# Altium project BE-PC_EXP_V100.PrjPcb (part 4 of 4)

## Sheet 06_SAMA7G54-DDR3.SchDoc
size 420 x 297 mm; SheetNumber: 29; SheetTotal: 29
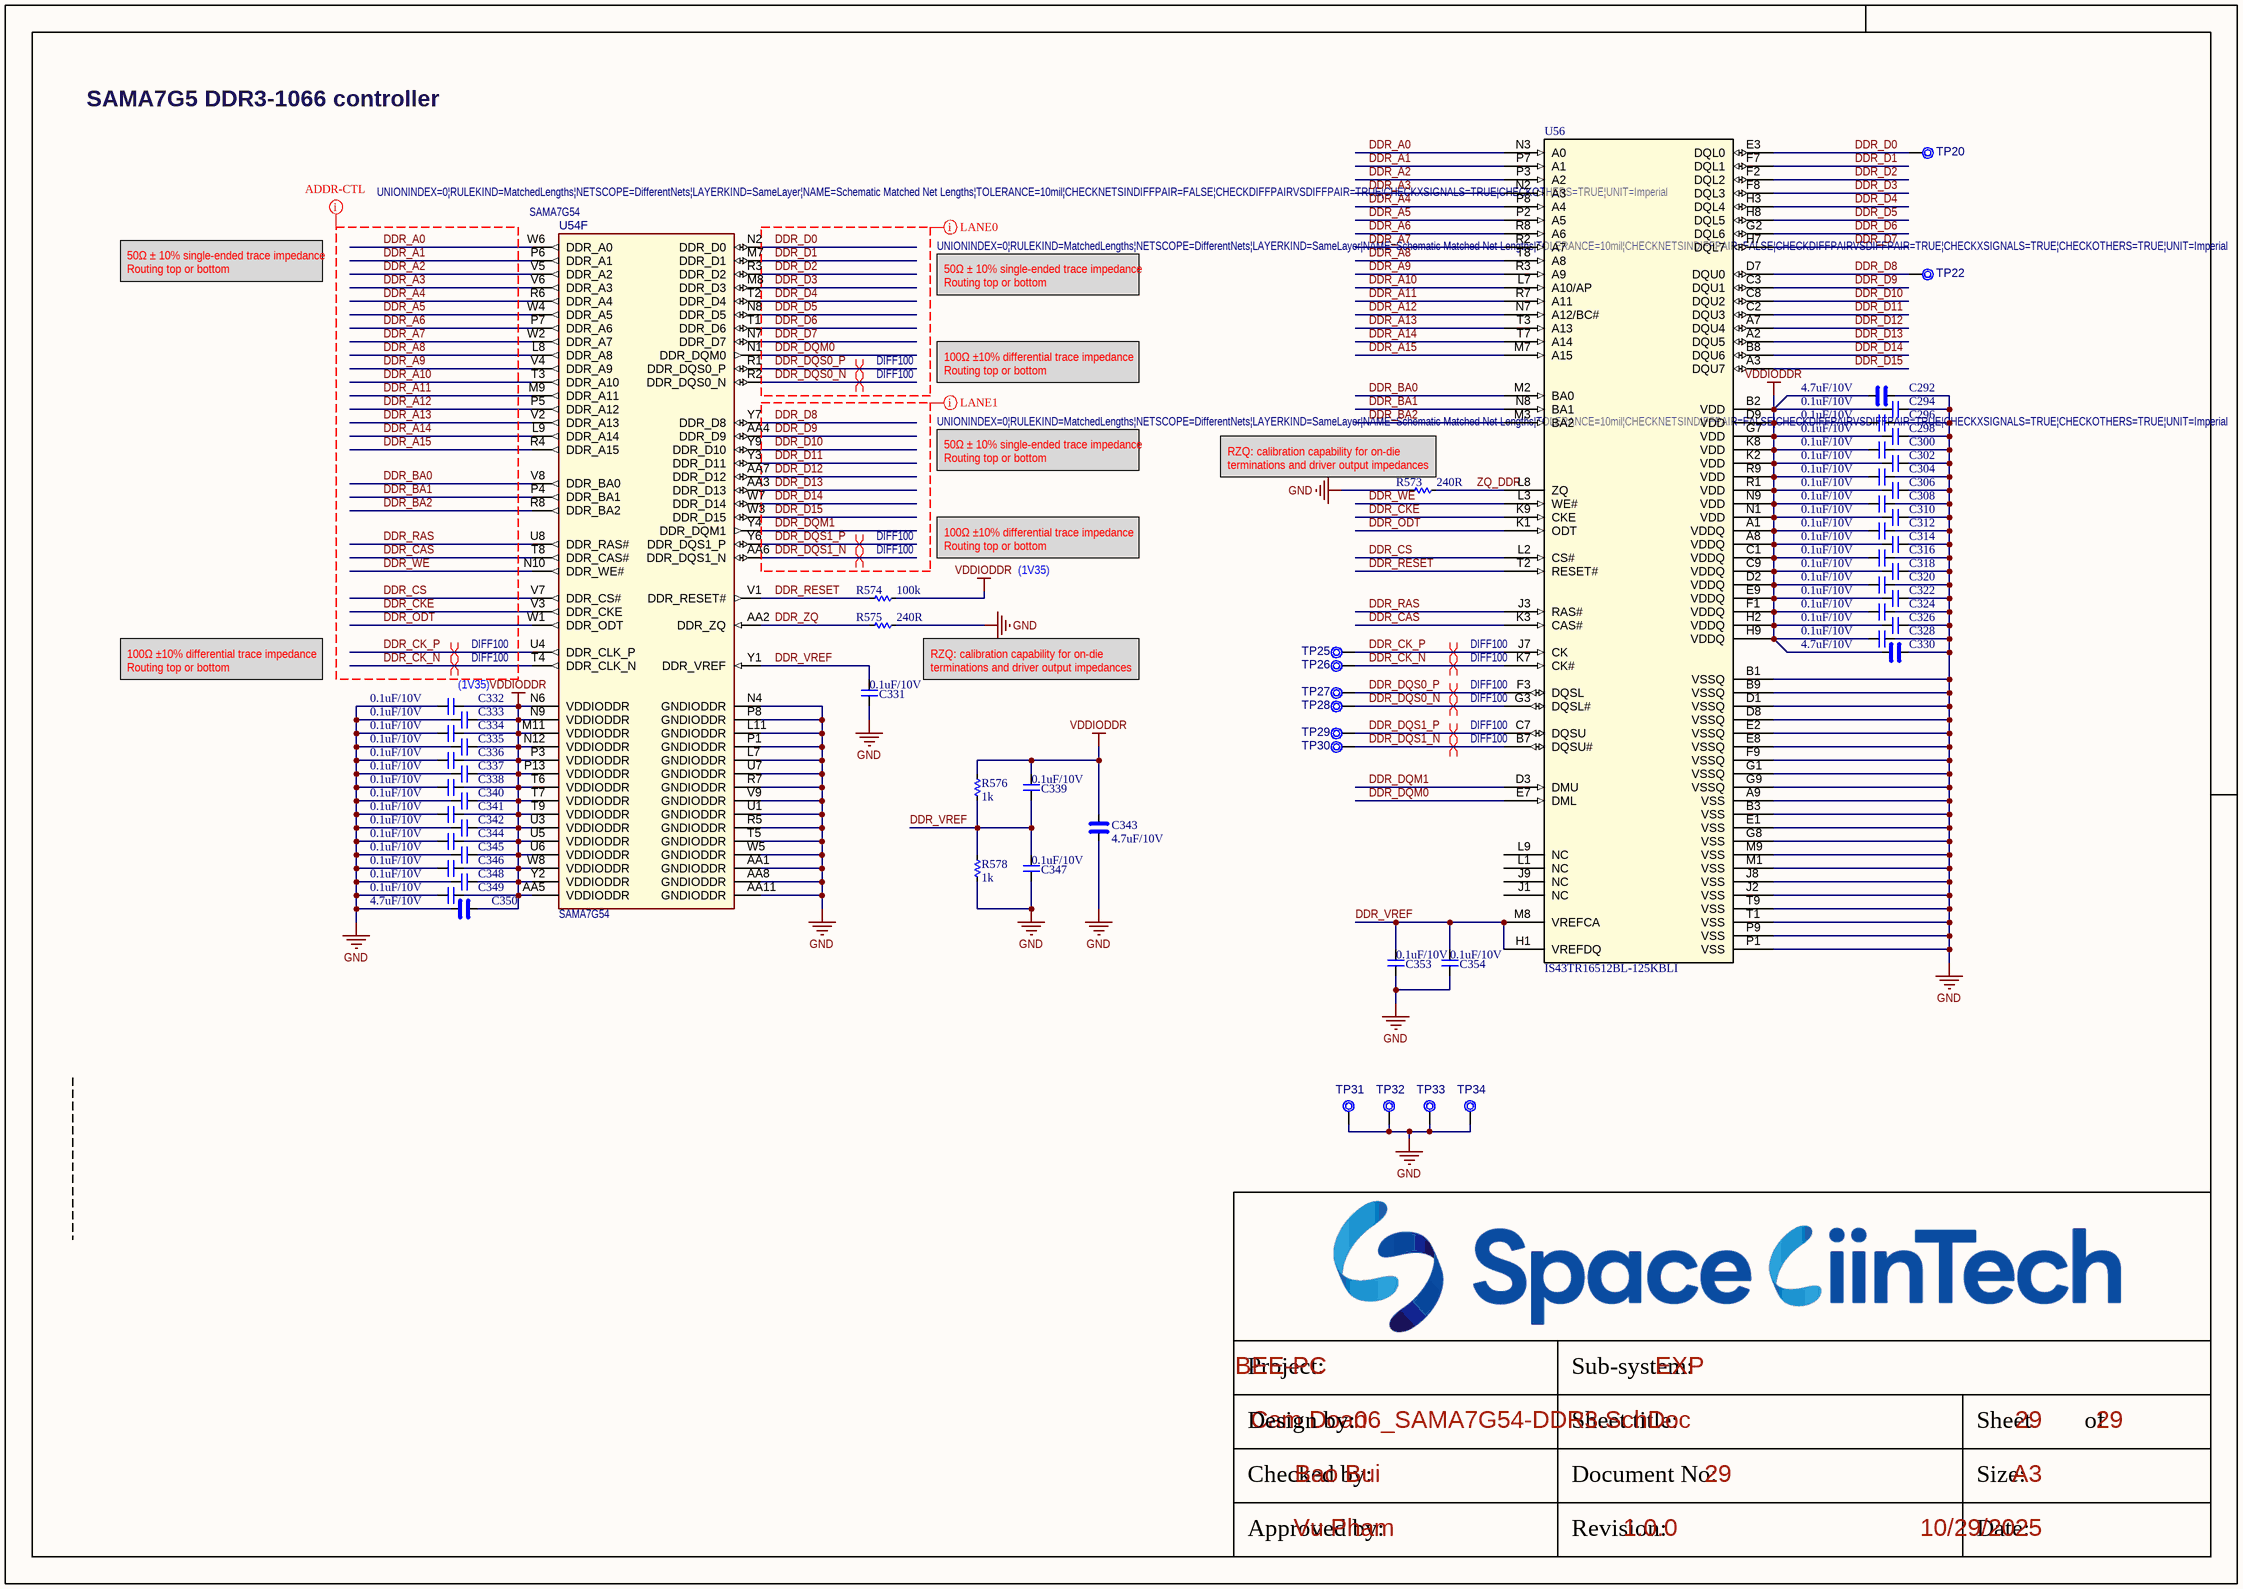
[diagram p35: 06_SAMA7G54-DDR3.SchDoc]

### Parts
C292  4.7uF/10V  [CAP_C_1005X50_L]
C294  0.1uF/10V  [CAP_C_0603x30]
C296  0.1uF/10V  [CAP_C_0603x30]
C298  0.1uF/10V  [CAP_C_0603x30]
C300  0.1uF/10V  [CAP_C_0603x30]
C302  0.1uF/10V  [CAP_C_0603x30]
C304  0.1uF/10V  [CAP_C_0603x30]
C306  0.1uF/10V  [CAP_C_0603x30]
C308  0.1uF/10V  [CAP_C_0603x30]
C310  0.1uF/10V  [CAP_C_0603x30]
C312  0.1uF/10V  [CAP_C_0603x30]
C314  0.1uF/10V  [CAP_C_0603x30]
C316  0.1uF/10V  [CAP_C_0603x30]
C318  0.1uF/10V  [CAP_C_0603x30]
C320  0.1uF/10V  [CAP_C_0603x30]
C322  0.1uF/10V  [CAP_C_0603x30]
C324  0.1uF/10V  [CAP_C_0603x30]
C326  0.1uF/10V  [CAP_C_0603x30]
C328  0.1uF/10V  [CAP_C_0603x30]
C330  4.7uF/10V  [CAP_C_1005X50_L]
C331  0.1uF/10V  [CAP_C_0603x30]
C332  0.1uF/10V  [CAP_C_0603x30]
C333  0.1uF/10V  [CAP_C_0603x30]
C334  0.1uF/10V  [CAP_C_0603x30]
C335  0.1uF/10V  [CAP_C_0603x30]
C336  0.1uF/10V  [CAP_C_0603x30]
C337  0.1uF/10V  [CAP_C_0603x30]
C338  0.1uF/10V  [CAP_C_0603x30]
C339  0.1uF/10V  [CAP_C_0603x30]
C340  0.1uF/10V  [CAP_C_0603x30]
C341  0.1uF/10V  [CAP_C_0603x30]
C342  0.1uF/10V  [CAP_C_0603x30]
C343  4.7uF/10V  [CAP_C_1005X60]
C344  0.1uF/10V  [CAP_C_0603x30]
C345  0.1uF/10V  [CAP_C_0603x30]
C346  0.1uF/10V  [CAP_C_0603x30]
C347  0.1uF/10V  [CAP_C_0603x30]
C348  0.1uF/10V  [CAP_C_0603x30]
C349  0.1uF/10V  [CAP_C_0603x30]
C350  4.7uF/10V  [CAP_C_1005X50_L]
C353  0.1uF/10V  [CAP_C_0603x30]
C354  0.1uF/10V  [CAP_C_0603x30]
R573  240R  [RES_C_0603X30]
R574  100k  [RES_C_0603X30]
R575  240R  [RES_C_0603X30]
R576  1k  [RES_C_0603X30]
R578  1k  [RES_C_0603X30]
TP20  Test Point No BOM  [Testpoint_80]  (value not drawn)  (no BOM)
TP22  Test Point No BOM  [Testpoint_80]  (value not drawn)  (no BOM)
TP25  Test Point No BOM  [Testpoint_80]  (value not drawn)  (no BOM)
TP26  Test Point No BOM  [Testpoint_80]  (value not drawn)  (no BOM)
TP27  Test Point No BOM  [Testpoint_80]  (value not drawn)  (no BOM)
TP28  Test Point No BOM  [Testpoint_80]  (value not drawn)  (no BOM)
TP29  Test Point No BOM  [Testpoint_80]  (value not drawn)  (no BOM)
TP30  Test Point No BOM  [Testpoint_80]  (value not drawn)  (no BOM)
TP31  Test Point No BOM  [Testpoint_80]  (value not drawn)  (no BOM)
TP32  Test Point No BOM  [Testpoint_80]  (value not drawn)  (no BOM)
TP33  Test Point No BOM  [Testpoint_80]  (value not drawn)  (no BOM)
TP34  Test Point No BOM  [Testpoint_80]  (value not drawn)  (no BOM)
U54  SAMA7G54  [TFBGA-343_14x14]  (part F of 8)
U56  IS43TR16512BL-125KBLI  [TWBGA96_ISI]

### Nets
GND: C292.1 C294.1 C296.1 C298.1 C300.1 C302.1 C304.1 C306.1 C308.1 C310.1 C312.1 C314.1 C316.1 C318.1 C320.1 C322.1 C324.1 C326.1 C328.1 C330.1 C331.2 C332.2 C333.2 C334.2 C335.2 C336.2 C337.2 C338.2 C340.2 C341.2 C342.2 C343.2 C344.2 C345.2 C346.2 C347.2 C348.2 C349.2 C350.2 C353.2 C354.2 R573.2 R575.1 R578.2 TP31.1 TP32.1 TP33.1 TP34.1 U54.AA1(GNDIODDR) U54.AA8(GNDIODDR) U54.AA11(GNDIODDR) U54.L7(GNDIODDR) U54.L11(GNDIODDR) U54.N4(GNDIODDR) U54.P1(GNDIODDR) U54.P8(GNDIODDR) U54.R5(GNDIODDR) U54.R7(GNDIODDR) U54.T5(GNDIODDR) U54.U1(GNDIODDR) U54.U7(GNDIODDR) U54.V9(GNDIODDR) U54.W5(GNDIODDR) U56.A9(VSS) U56.B1(VSSQ) U56.B3(VSS) U56.B9(VSSQ) U56.D1(VSSQ) U56.D8(VSSQ) U56.E1(VSS) U56.E2(VSSQ) U56.E8(VSSQ) U56.F9(VSSQ) U56.G1(VSSQ) U56.G8(VSS) U56.G9(VSSQ) U56.J2(VSS) U56.J8(VSS) U56.M1(VSS) U56.M9(VSS) U56.P1(VSS) U56.P9(VSS) U56.T1(VSS) U56.T9(VSS)
VDDIODDR: C292.2 C294.2 C296.2 C298.2 C300.2 C302.2 C304.2 C306.2 C308.2 C310.2 C312.2 C314.2 C316.2 C318.2 C320.2 C322.2 C324.2 C326.2 C328.2 C330.2 C332.1 C333.1 C334.1 C335.1 C336.1 C337.1 C338.1 C339.1 C340.1 C341.1 C342.1 C343.1 C344.1 C345.1 C346.1 C348.1 C349.1 C350.1 R574.1 R576.1 U54.AA5(VDDIODDR) U54.M11(VDDIODDR) U54.N6(VDDIODDR) U54.N9(VDDIODDR) U54.N12(VDDIODDR) U54.P3(VDDIODDR) U54.P13(VDDIODDR) U54.T6(VDDIODDR) U54.T7(VDDIODDR) U54.T9(VDDIODDR) U54.U3(VDDIODDR) U54.U5(VDDIODDR) U54.U6(VDDIODDR) U54.W8(VDDIODDR) U54.Y2(VDDIODDR) U56.A1(VDDQ) U56.A8(VDDQ) U56.B2(VDD) U56.C1(VDDQ) U56.C9(VDDQ) U56.D2(VDDQ) U56.D9(VDD) U56.E9(VDDQ) U56.F1(VDDQ) U56.G7(VDD) U56.H2(VDDQ) U56.H9(VDDQ) U56.K2(VDD) U56.K8(VDD) U56.N1(VDD) U56.N9(VDD) U56.R1(VDD) U56.R9(VDD)
DDR_A0: U54.W6(DDR_A0) U56.N3(A0)
DDR_A1: U54.P6(DDR_A1) U56.P7(A1)
DDR_A2: U54.V5(DDR_A2) U56.P3(A2)
DDR_A3: U54.V6(DDR_A3) U56.N2(A3)
DDR_A4: U54.R6(DDR_A4) U56.P8(A4)
DDR_A5: U54.W4(DDR_A5) U56.P2(A5)
DDR_A6: U54.P7(DDR_A6) U56.R8(A6)
DDR_A7: U54.W2(DDR_A7) U56.R2(A7)
DDR_A8: U54.L8(DDR_A8) U56.T8(A8)
DDR_A9: U54.V4(DDR_A9) U56.R3(A9)
DDR_A10: U54.T3(DDR_A10) U56.L7(A10/AP)
DDR_A11: U54.M9(DDR_A11) U56.R7(A11)
DDR_A12: U54.P5(DDR_A12) U56.N7(A12/BC#)
DDR_A13: U54.V2(DDR_A13) U56.T3(A13)
DDR_A14: U54.L9(DDR_A14) U56.T7(A14)
DDR_A15: U54.R4(DDR_A15) U56.M7(A15)
DDR_BA0: U54.V8(DDR_BA0) U56.M2(BA0)
DDR_BA1: U54.P4(DDR_BA1) U56.N8(BA1)
DDR_BA2: U54.R8(DDR_BA2) U56.M3(BA2)
DDR_CAS: U54.T8(DDR_CAS#) U56.K3(CAS#)
DDR_CK_N: TP26.1 U54.T4(DDR_CLK_N) U56.K7(CK#)
DDR_CK_P: TP25.1 U54.U4(DDR_CLK_P) U56.J7(CK)
DDR_CKE: U54.V3(DDR_CKE) U56.K9(CKE)
DDR_CS: U54.V7(DDR_CS#) U56.L2(CS#)
DDR_D0: TP20.1 U54.N2(DDR_D0) U56.E3(DQL0)
DDR_D1: U54.M7(DDR_D1) U56.F7(DQL1)
DDR_D2: U54.R3(DDR_D2) U56.F2(DQL2)
DDR_D3: U54.M8(DDR_D3) U56.F8(DQL3)
DDR_D4: U54.T2(DDR_D4) U56.H3(DQL4)
DDR_D5: U54.N8(DDR_D5) U56.H8(DQL5)
DDR_D6: U54.T1(DDR_D6) U56.G2(DQL6)
DDR_D7: U54.N7(DDR_D7) U56.H7(DQL7)
DDR_D8: TP22.1 U54.Y7(DDR_D8) U56.D7(DQU0)
DDR_D9: U54.AA4(DDR_D9) U56.C3(DQU1)
DDR_D10: U54.Y9(DDR_D10) U56.C8(DQU2)
DDR_D11: U54.Y3(DDR_D11) U56.C2(DQU3)
DDR_D12: U54.AA7(DDR_D12) U56.A7(DQU4)
DDR_D13: U54.AA3(DDR_D13) U56.A2(DQU5)
DDR_D14: U54.W7(DDR_D14) U56.B8(DQU6)
DDR_D15: U54.W3(DDR_D15) U56.A3(DQU7)
DDR_DQM0: U54.N1(DDR_DQM0) U56.E7(DML)
DDR_DQM1: U54.Y4(DDR_DQM1) U56.D3(DMU)
DDR_DQS0_N: TP28.1 U54.R2(DDR_DQS0_N) U56.G3(DQSL#)
DDR_DQS0_P: TP27.1 U54.R1(DDR_DQS0_P) U56.F3(DQSL)
DDR_DQS1_N: TP30.1 U54.AA6(DDR_DQS1_N) U56.B7(DQSU#)
DDR_DQS1_P: TP29.1 U54.Y6(DDR_DQS1_P) U56.C7(DQSU)
DDR_ODT: U54.W1(DDR_ODT) U56.K1(ODT)
DDR_RAS: U54.U8(DDR_RAS#) U56.J3(RAS#)
DDR_RESET: R574.2 U54.V1(DDR_RESET#) U56.T2(RESET#)
DDR_VREF: C331.1 C339.2 C347.1 C353.1 C354.1 R576.2 R578.1 U54.Y1(DDR_VREF) U56.H1(VREFDQ) U56.M8(VREFCA)
DDR_WE: U54.N10(DDR_WE#) U56.L3(WE#)
DDR_ZQ: R575.2 U54.AA2(DDR_ZQ)
ZQ_DDR: R573.1 U56.L8(ZQ)

Not connected (* = marked no-connect by the designer): U56 J1(NC) J9(NC) L1(NC) L9(NC)

### Layout directives
net class DDR-LANE0; rule Matched Net Lengths [Tolerance = 10mil]: DDR_D0, DDR_D1, DDR_D2, DDR_D3, DDR_D4, DDR_D5, DDR_D6, DDR_D7, DDR_DQM0, DDR_DQS0_N, DDR_DQS0_P
net class DDR-LANE1; rule Matched Net Lengths [Tolerance = 10mil]: DDR_D8, DDR_D9, DDR_D10, DDR_D11, DDR_D12, DDR_D13, DDR_D14, DDR_D15, DDR_DQM1, DDR_DQS1_N, DDR_DQS1_P
net class DDR-ADDR-CTL; rule Matched Net Lengths [Tolerance = 10mil]: DDR_A0, DDR_A1, DDR_A2, DDR_A3, DDR_A4, DDR_A5, DDR_A6, DDR_A7, DDR_A8, DDR_A9, DDR_A10, DDR_A11, DDR_A12, DDR_A13, DDR_A14, DDR_A15, DDR_BA0, DDR_BA1, DDR_BA2, DDR_CAS, DDR_CK_N, DDR_CK_P, DDR_CKE, DDR_CS, DDR_ODT, DDR_RAS, DDR_WE
differential pair; differential pair class DIFF100; net class DIFF100; rule Matched Net Lengths [Tolerance = 4mil]: DDR_CK_N, DDR_CK_P, DDR_DQS0_N, DDR_DQS0_P, DDR_DQS1_N, DDR_DQS1_P

### Notes on the sheet
- SAMA7G5 DDR3-1066 controller
- 50Ω ± 10% single-ended trace impedance
  Routing top or bottom
- 100Ω ±10% differential trace impedance
  Routing top or bottom
- (near R573) RZQ: calibration capability for on-die terminations and driver output impedances
- (1V35)
- (near C332) (1V35)
- RZQ: calibration capability for on-die terminations and driver output impedances
- Project:
- Sub-system:
- Design by:
- Sheet title:
- Sheet
- of
- Checked by:
- Approved by:
- Revision:
- Document No:
- Size:
- Date:
- A3

### Library data of the parts
C292 C330 C343 C350 = _CAP_C_High_2: CAP CHIP High Value
C294 C296 C298 C300 C302 C304 C306 C308 C310 C312 C314 C316 C318 C320 C322 C324 C326 C328 C331-C342 C344-C349 C353 C354 = _CAP_C_2: CAP CHIP
R573-R576 R578 = _RES_B_2: RES
TP20 TP22 TP25-TP34 = CON1759: Test Point; Value: TP PAD PCB 1mm; Description_: CON TP PAD PCB 1mm SMD; Dev Tools Status: Design; Owner: Cristian Papuc; Populated: YES; MCHP-ID: CON1759; Revision: A; Symbol: Test Point No BOM; Status: MCL Design; ComponentLink1Description: SVN Datasheet; ComponentLink2Description: Local Datasheet; ComponentLink3URL: C:\ALTIUM_WORK\00001_MCHP-CDB\Library\LibraryRefs\Test Point No BOM.SchLib; ComponentLink3Description: Open Symbol; ComponentLink4URL: C:\ALTIUM_WORK\00001_MCHP-CDB\Library\Footprints\TP_1mm_SMD.PcbLib; ComponentLink4Description: Open Footprint; ComponentLink5Description: Open Footprint 2; ComponentLink6Description: Open Footprint 3; ComponentLink7Description: Open Footprint 4; Type: Test Point; Category: Connector; Quantity Override: 1
U54 = MIC8923: SAMA7G54 MPU 1000MHz Cortex-A7 TFBGA-343; Manufacturer Part Number 1: SAMA7G54-V/4HB; Manufacturer 1: Microchip; Description_: MCHP MPU 32-BIT Cortex-A7 1000MHz 128kB SAMA7G54-V/4HB TFBGA-343; Populated: YES; Dev Tools Status: Design; Owner: Ciprian Abramov; Package: TFBGA-343; MCHP-ID: MIC8923; Value: SAMA7G54; Symbol: SAMA7G54 TFBGA-343; Type: 32-Bit MPU; Status: MCL Design; Revision: 1; Category: MCHP-Microcontroller; ComponentLink1Description: SVN Datasheet; ComponentLink2Description: Local Datasheet; ComponentLink3URL: C:\ALTIUM_WORK\00001_MCHP-CDB\Library\LibraryRefs\SAMA7G54 TFBGA-343.SchLib; ComponentLink3Description: Open Symbol; ComponentLink4URL: C:\ALTIUM_WORK\00001_MCHP-CDB\Library\Footprints\TFBGA-343_14x14.PcbLib; ComponentLink4Description: Open Footprint; ComponentLink5Description: Open Footprint 2; ComponentLink6Description: Open Footprint 3; ComponentLink7Description: Open Footprint 4; Supplier 1: Microchip; Supplier Part Number 1: SAMA7G54-V/4HB; Quantity Override: 1
U56 = IC_RAM_IS43TR16512BL-125KBLI: DDR3L; Manufacturer_Name: ISSI; Copyright: Copyright (C) 2025 Ultra Librarian. All rights reserved.; Manufacturer_Part_Number: IS43TR16512BL-125KBLI; RefDes: RefDes; Type: Type

## Nets that join several sheets
+1.8V: 05_POWER_MCU_1 (C183.1 U40.5), 06_SOM_CAM (C187.2 U44.18)
+3.3_VBAT: 09_MRAM_RTC_WDT (C191.2 J19.1 U36.9), 06_SAMA7G54-MPU (R370.1)
+3.3V: 04_CONNECTOR_OUT (R299.1 R300.1 R301.1 R302.1), 04_CONNECTOR_OUT_2 (22 pins), 05_POWER_MCU_1 (8 pins), 05_POWER_MCU_2 (C321.2 R622.1 R624.1 U60.26), 06_SOM_Console (C291.2 C293.2 U55.3 U57.3), 06_SOM_CAM (12 pins), 09_MRAM_RTC_WDT (25 pins), 10_NTC_TEMPSENSOR (17 pins), 12_TEC (15 pins), 13_FLOW_Sensor (36 pins), 13_Sensors_Onboard (14 pins), 14_HD4_PUMP (C109.2 R162.1 R163.1 U16.1), 15_SOLENOID 2 (6 pins)
+3.3V_MCU: 05_POWER_MCU_1 (5 pins), 06_SOM_Console (C133.2 J17.1 R213.2 R214.2), 08_MCU (23 pins), 09_MRAM_RTC_WDT (C179.2 R398.2 U39.1)
+3.3V_SOM: 05_POWER_SAMA7.Doc (5 pins), 07_USB (8 pins)
+3/5V_Solenoid: 05_POWER_MCU_1 (7 pins), 15_SOLEDNOID (8 pins), 15_SOLENOID 2 (32 pins)
+3V_SOLENOID: 05_POWER_MCU_1 (JP4.1), 05_POWER_MCU_2 (7 pins)
+5V: 05_POWER_MCU_1 (9 pins), 06_SOM_CAM (J26.11 J27.11), 10_NTC_TEMPSENSOR (C106.2 U14.1), 15_SOLEDNOID (R271.1 R274.1 R277.1 R280.1)
+5V_ADT2: 04_CONNECTOR_IN (D40.2 J1.9), 05_POWER_MCU_1 (14 pins), 05_POWER_MCU_2 (9 pins)
+5V_HD4: 05_POWER_MCU_1 (7 pins), 14_HD4_PUMP (10 pins)
+5V_MCU: 05_POWER_SAMA7.Doc (R5.2), 05_POWER_MCU_1 (15 pins), 05_POWER_MCU_2 (R637.2)
+5V_SAMA7: 05_POWER_SAMA7.Doc (9 pins), 06_SOM_USB_CARD (JP2.1), 06_SAMA7G54-PMIC (13 pins), 06_SAMA7G54-PIO (R569.1)
+5V_TEC: 05_POWER_MCU_1 (7 pins), 12_TEC (20 pins)
+5V_USB_ADT1: 04_CONNECTOR_IN (C9.2 D2.5 D38.2 J1.4), 05_POWER_SAMA7.Doc (5 pins)
+5V_USB_ADT2: 04_CONNECTOR_IN (C10.2 D3.5 D39.2 J1.8), 05_POWER_MCU_1 (5 pins)
+12V_ADT2: 04_CONNECTOR_IN (D41.2 J1.10), 05_POWER_MCU_1 (9 pins), 05_POWER_MCU_2 (C360.2 JP15.1 R633.2 U61.5)
+12V_Heater: 05_POWER_MCU_2 (7 pins), 11_HEATER (9 pins)
+12V_Laser: 04_CONNECTOR_OUT_2 (J24.1 J25.1), 05_POWER_MCU_1 (7 pins)
+12V_Photo: 04_CONNECTOR_OUT (J22.1), 04_CONNECTOR_OUT_2 (J20.1 J21.1), 05_POWER_MCU_1 (7 pins)
GND: 04_CONNECTOR_IN (12 pins), 04_CONNECTOR_OUT (J22.2 J22.M1 J22.M2), 04_CONNECTOR_OUT_2 (26 pins), 05_POWER_SAMA7.Doc (16 pins), 05_POWER_MCU_1 (84 pins), 05_POWER_MCU_2 (38 pins), 06_SOM_USB_CARD (15 pins), 06_SOM_Console (19 pins), 06_SOM_CAM (21 pins), 07_eMMC (29 pins), 07_USB (20 pins), 08_MCU (49 pins), 09_MRAM_RTC_WDT (18 pins), 10_NTC_TEMPSENSOR (39 pins), 11_HEATER (11 pins), 12_TEC (66 pins), 13_FLOW_Sensor (34 pins), 13_Sensors_Onboard (11 pins), 14_HD4_PUMP (14 pins), 15_SOLEDNOID (22 pins), 15_SOLENOID 2 (44 pins), MOUTING (H10.1 H11.1 H13.1 H14.1), 06_SAMA7G54-PMIC (30 pins), 06_SAMA7G54-MPU (113 pins), 06_SAMA7G54-PIO (8 pins), 06_SAMA7G54-DDR3 (84 pins)
VDD_3V3: 06_SOM_USB_CARD (17 pins), 06_SOM_Console (C132.2 J16.1 R209.2 R210.2), 07_eMMC (37 pins), 06_SAMA7G54-PMIC (18 pins), 06_SAMA7G54-MPU (6 pins), 06_SAMA7G54-PIO (9 pins)
VDD_3V3_MPU: 06_SAMA7G54-PMIC (6 pins), 06_SAMA7G54-MPU (18 pins)
VDDBU: 06_SAMA7G54-PMIC (R322.2), 06_SAMA7G54-MPU (5 pins)
VDDCORE: 06_SAMA7G54-PMIC (R326.2 TP8.1), 06_SAMA7G54-MPU (30 pins)
VDDCPU: 06_SAMA7G54-PMIC (R330.2 TP10.1), 06_SAMA7G54-MPU (11 pins)
VDDIN33: 06_SAMA7G54-PMIC (R332.1), 06_SAMA7G54-MPU (C279.1 C280.1 R364.1 U54.H3)
VDDIODDR: 06_SAMA7G54-PMIC (R335.2 TP15.1), 06_SAMA7G54-DDR3 (73 pins)
VDDUTMII: 06_SAMA7G54-PMIC (R333.1), 06_SAMA7G54-MPU (11 pins)
_PC9: 06_SAMA7G54-PMIC (R303.2 R310.1 R325.2), 06_SAMA7G54-PIO (U54.G2)
_PC10: 06_SAMA7G54-PMIC (R298.2 R305.1 R327.2), 06_SAMA7G54-PIO (U54.M10)
ADC_eFUSEs: 05_POWER_MCU_2 (8 pins), 08_MCU (R123.1)
ADC_SWITCH: 08_MCU (R522.1), 12_TEC (8 pins)
ADC_TEMP1: 08_MCU (R100.2), 10_NTC_TEMPSENSOR (C88.2 R133.2)
ADC_TEMP2: 08_MCU (R104.2), 10_NTC_TEMPSENSOR (C93.2 R139.2)
ADC_TEMP3: 08_MCU (R297.1), 10_NTC_TEMPSENSOR (C99.2 R145.2)
ADC_TEMP4: 08_MCU (R520.1), 10_NTC_TEMPSENSOR (C103.2 R151.2)
ADC_TEMP5: 08_MCU (R524.2), 10_NTC_TEMPSENSOR (C90.2 R134.2)
ADC_TEMP6: 08_MCU (R523.2), 10_NTC_TEMPSENSOR (C95.2 R140.2)
ADC_TEMP7: 08_MCU (R521.1), 10_NTC_TEMPSENSOR (C101.2 R146.2)
ADC_TEMP8: 08_MCU (R526.2), 10_NTC_TEMPSENSOR (C105.2 R152.2)
ADT1_USB_D_N: 04_CONNECTOR_IN (D2.4), 06_SAMA7G54-MPU (R336.1)
ADT1_USB_D_P: 04_CONNECTOR_IN (D2.6), 06_SAMA7G54-MPU (R337.1)
ADT2_USB_D_N: 04_CONNECTOR_IN (D3.4), 08_MCU (U2.136)
ADT2_USB_D_P: 04_CONNECTOR_IN (D3.6), 08_MCU (U2.137)
BMP390_INT: 08_MCU (R11.1), 13_Sensors_Onboard (R531.2 U51.7)
eFUSE_ILIM_3/5V_Solenoid: 05_POWER_MCU_1 (R230.2 U24.9), 05_POWER_MCU_2 (C325.2 U60.3)
eFUSE_ILIM_5V: 05_POWER_MCU_1 (R245.2 U25.9), 05_POWER_MCU_2 (C351.2 U60.6)
eFUSE_ILIM_5V_HD4: 05_POWER_MCU_1 (R270.2 U29.9), 05_POWER_MCU_2 (C352.2 U60.7)
eFUSE_ILIM_5V_MCU: 05_POWER_MCU_1 (R226.2 U23.9), 05_POWER_MCU_2 (C329.2 U60.5)
eFUSE_ILIM_5V_SOM: 05_POWER_SAMA7.Doc (R8.2 U1.9), 05_POWER_MCU_2 (C323.2 U60.2)
eFUSE_ILIM_5V_TEC: 05_POWER_MCU_1 (R262.2 U28.9), 05_POWER_MCU_2 (C327.2 U60.4)
eFUSE_ILIM_12V_Heater: 05_POWER_MCU_2 (R640.2 U61.9), 12_TEC (C357.2 U9.6)
eFUSE_ILIM_12V_Laser: 05_POWER_MCU_1 (R261.2 U27.9), 05_POWER_MCU_2 (C355.2 U60.8)
eFUSE_ILIM_12V_Photo: 05_POWER_MCU_1 (R246.2 U26.9), 05_POWER_MCU_2 (C356.2 U60.9)
HEATER_PWM_1: 08_MCU (R36.2), 11_HEATER (R125.1)
HEATER_PWM_2: 08_MCU (R9.2), 11_HEATER (R127.1)
HEATER_PWM_3: 08_MCU (R10.2), 11_HEATER (R129.1)
HEATER_PWM_4: 08_MCU (R35.2), 11_HEATER (R131.1)
LASER_ADC_1: 04_CONNECTOR_OUT_2 (U43.7), 08_MCU (R528.2)
LASER_ADC_2: 04_CONNECTOR_OUT_2 (U43.9), 08_MCU (R627.2)
LASER_CHOSE: 04_CONNECTOR_OUT_2 (R175.2 U42.11 U43.11 U43.21), 08_MCU (R595.1)
LASER_DAC_LATCH: 04_CONNECTOR_OUT_2 (U43.3), 08_MCU (R65.2)
LASER_SPI_nCS1: 04_CONNECTOR_OUT_2 (U43.1), 08_MCU (R42.2)
LASER_SW_EXT_CS: 04_CONNECTOR_OUT_2 (U43.6), 08_MCU (R54.2)
LASER_SW_INT_CS: 04_CONNECTOR_OUT_2 (U43.4), 08_MCU (R53.2)
LPM: 06_SAMA7G54-PMIC (Q23.1 R167.2), 06_SAMA7G54-MPU (U54.R10)
LSM6D_INT1: 08_MCU (R71.2), 13_Sensors_Onboard (R533.2 U52.4)
MCP16502_HPM: 06_SAMA7G54-PMIC (R296.2), 06_SAMA7G54-PIO (R569.2 R572.1 U54.N15)
MCU_CAN1_RX: 06_SOM_Console (U57.4), 08_MCU (R582.2)
MCU_CAN1_TX: 06_SOM_Console (U57.1), 08_MCU (R583.2)
MCU_CONSOLE_RX: 06_SOM_Console (J17.3 R214.1), 08_MCU (R291.1)
MCU_CONSOLE_TX: 06_SOM_Console (J17.2 R213.1), 08_MCU (R292.1)
MCU_FRAM_nCS: 08_MCU (R612.1), 09_MRAM_RTC_WDT (R614.1 U59.1)
MCU_HD4_I2C2_SCL: 08_MCU (R39.1), 14_HD4_PUMP (R106.2 R162.2), 15_SOLENOID 2 (R619.2)
MCU_HD4_I2C2_SDA: 08_MCU (R37.1), 14_HD4_PUMP (R163.2 R617.2), 15_SOLENOID 2 (R618.2)
MCU_HD4_I2C_EN: 08_MCU (R67.2), 14_HD4_PUMP (R168.1 U16.5)
MCU_I2C0_SCL: 08_MCU (R14.2), 13_FLOW_Sensor (6 pins)
MCU_I2C0_SDA: 08_MCU (R13.2), 13_FLOW_Sensor (6 pins)
MCU_MRAM_QSPI_CLK: 08_MCU (R24.2), 09_MRAM_RTC_WDT (U35.6)
MCU_MRAM_QSPI_IO0: 08_MCU (R23.2), 09_MRAM_RTC_WDT (U35.5)
MCU_MRAM_QSPI_IO1: 08_MCU (R21.2), 09_MRAM_RTC_WDT (U35.2)
MCU_MRAM_QSPI_IO2: 08_MCU (R27.2), 09_MRAM_RTC_WDT (U35.3)
MCU_MRAM_QSPI_IO3: 08_MCU (R43.1), 09_MRAM_RTC_WDT (U35.7)
MCU_PRAM_SPI1_nCS: 08_MCU (R78.2), 09_MRAM_RTC_WDT (R529.1 U37.2)
MCU_PRAM_SW_nEN: 08_MCU (R286.1), 09_MRAM_RTC_WDT (R397.1 U37.15)
MCU_RAM_QSPI_nCS: 08_MCU (R19.2), 09_MRAM_RTC_WDT (R388.1 U35.1)
MCU_RTC_CLKOUT: 08_MCU (R49.2), 09_MRAM_RTC_WDT (R389.1 U36.3)
MCU_RTC_INT: 08_MCU (R50.2), 09_MRAM_RTC_WDT (R390.1 U36.7)
MCU_SENSOR1_nIRQ: 08_MCU (R109.1), 13_FLOW_Sensor (R169.2)
MCU_SENSOR2_nIRQ: 08_MCU (R110.1), 13_FLOW_Sensor (R179.2)
MCU_SENSOR3_nIRQ: 08_MCU (R114.1), 13_FLOW_Sensor (R81.2)
MCU_SENSOR4_nIRQ: 08_MCU (R116.1), 13_FLOW_Sensor (R112.2)
MCU_SOL_1_IN1: 08_MCU (R12.2), 15_SOLEDNOID (U30.3)
MCU_SOL_1_IN2: 08_MCU (R69.2), 15_SOLEDNOID (U30.2)
MCU_SOL_2_IN1: 08_MCU (R290.1), 15_SOLEDNOID (U31.3)
MCU_SOL_2_IN2: 08_MCU (R616.1), 15_SOLEDNOID (U31.2)
MCU_SOL_3_IN1: 08_MCU (R32.2), 15_SOLEDNOID (U32.3)
MCU_SOL_3_IN2: 08_MCU (R30.2), 15_SOLEDNOID (U32.2)
MCU_SOL_4_IN1: 08_MCU (R34.2), 15_SOLEDNOID (U33.3)
MCU_SOL_4_IN2: 08_MCU (R33.2), 15_SOLEDNOID (U33.2)
MCU_SOM_GPIO_A: 08_MCU (R283.1), 06_SAMA7G54-PIO (R478.1)
MCU_SOM_GPIO_B: 08_MCU (R284.1), 06_SAMA7G54-PIO (R474.1)
MCU_SPI0_MISO: 04_CONNECTOR_OUT_2 (U41.4 U42.7), 08_MCU (R28.1 R80.1)
MCU_SPI0_MOSI: 04_CONNECTOR_OUT_2 (U41.3 U42.6), 08_MCU (R29.1)
MCU_SPI0_SCK: 04_CONNECTOR_OUT_2 (U41.1 U42.9), 08_MCU (R31.1)
MCU_SPI1_MISO: 08_MCU (R76.2), 09_MRAM_RTC_WDT (U37.14)
MCU_SPI1_MOSI: 08_MCU (R77.2), 09_MRAM_RTC_WDT (U37.11)
MCU_SPI1_SCK: 08_MCU (R74.2), 09_MRAM_RTC_WDT (U37.5)
MCU_UART0_RX_SOM_TX: 08_MCU (R17.2), 06_SAMA7G54-PIO (R563.1)
MCU_UART0_TX_SOM_RX: 08_MCU (R18.2), 06_SAMA7G54-PIO (R564.1)
MCU_UART1_RX_SOM_TX: 08_MCU (R15.2), 06_SAMA7G54-PIO (R561.1)
MCU_UART1_TX_SOM_RX: 08_MCU (R16.2), 06_SAMA7G54-PIO (R562.1)
MCU_USART_RXD2: 08_MCU (R287.1), 09_MRAM_RTC_WDT (U59.2), 12_TEC (U5.18 U6.18 U7.18 U8.18)
MCU_USART_SCK2: 08_MCU (R289.1), 09_MRAM_RTC_WDT (U59.6), 12_TEC (U5.16 U6.16 U7.16 U8.16)
MCU_USART_TXD2: 08_MCU (R288.1), 09_MRAM_RTC_WDT (U59.5), 12_TEC (U5.17 U6.17 U7.17 U8.17)
NetC288_1: 08_MCU (R525.2), 06_SAMA7G54-PMIC (R594.1), 06_SAMA7G54-MPU (C288.1 JP14.1)
NetC290_2: 09_MRAM_RTC_WDT (R394.1), 06_SAMA7G54-PMIC (R323.1 U34.2), 06_SAMA7G54-MPU (R581.1 U54.J7), 06_SAMA7G54-PIO (C290.2 R571.1)
NetQ23_3: 06_SAMA7G54-PMIC (Q23.3 R331.1), 06_SAMA7G54-MPU (Y2.1)
NetR318_2: 06_SAMA7G54-PMIC (R318.2 U53.1), 06_SAMA7G54-PIO (U54.D5)
NetR324_1: 06_SAMA7G54-PMIC (R324.1 U34.1), 06_SAMA7G54-PIO (U54.D19)
PHOTO_ADC_CONV: 04_CONNECTOR_OUT_2 (U41.9), 08_MCU (R25.2)
PHOTO_ADC_CS: 04_CONNECTOR_OUT_2 (U41.7), 08_MCU (R56.1)
PHOTO_ADC_EOC: 04_CONNECTOR_OUT_2 (U42.1), 08_MCU (R99.2)
PHOTO_CHOSE: 04_CONNECTOR_OUT_2 (R174.2 U41.11 U41.21 U42.21), 08_MCU (R124.1)
PHOTO_SPI0_nCS2: 04_CONNECTOR_OUT_2 (U41.6), 08_MCU (R22.1)
POW_ONOFF_5V: 05_POWER_MCU_1 (R237.2), 08_MCU (R51.1)
POW_ONOFF_HD4: 05_POWER_MCU_1 (R267.2), 08_MCU (R73.1)
POW_ONOFF_Heater: 05_POWER_MCU_2 (R636.2), 08_MCU (R632.1)
POW_ONOFF_Laser: 05_POWER_MCU_1 (R250.2), 08_MCU (R186.1)
POW_ONOFF_Photo: 05_POWER_MCU_1 (R238.2), 08_MCU (R185.1)
POW_ONOFF_Solenoid: 05_POWER_MCU_1 (R225.2), 08_MCU (R75.1)
POW_ONOFF_SOM: 05_POWER_SAMA7.Doc (R4.2), 08_MCU (R26.1)
POW_ONOFF_TEC: 05_POWER_MCU_1 (R258.2), 08_MCU (R52.1)
SAMA7_CAN0_RX: 06_SOM_Console (U55.4), 06_SAMA7G54-PIO (R591.1)
SAMA7_CAN0_TX: 06_SOM_Console (U55.1), 06_SAMA7G54-PIO (R590.1)
SD2_CLK: 06_SOM_USB_CARD (J15.P5 R195.1 U20.3), 06_SAMA7G54-PIO (R544.1)
SD2_CMD: 06_SOM_USB_CARD (J15.P3 R196.1 U21.6), 06_SAMA7G54-PIO (R541.1)
SD2_DATA0: 06_SOM_USB_CARD (J15.P7 R191.1 U20.6), 06_SAMA7G54-PIO (R545.1)
SD2_DATA1: 06_SOM_USB_CARD (J15.P8 R192.1 U20.1), 06_SAMA7G54-PIO (R552.1)
SD2_DATA2: 06_SOM_USB_CARD (J15.P1 R193.1 U21.3), 06_SAMA7G54-PIO (R553.1)
SD2_DATA3: 06_SOM_USB_CARD (J15.P2 R194.1 U21.4), 06_SAMA7G54-PIO (R554.1)
SD2_nCD: 06_SOM_USB_CARD (J15.P9 R197.2), 06_SAMA7G54-PIO (R555.1)
SENSOR1_EN: 08_MCU (R55.2), 13_FLOW_Sensor (R178.1 U17.5)
SENSOR2_EN: 08_MCU (R57.2), 13_FLOW_Sensor (R182.1 U18.5)
SENSOR3_EN: 08_MCU (R38.2), 13_FLOW_Sensor (R111.1 U49.5)
SENSOR4_EN: 08_MCU (R40.2), 13_FLOW_Sensor (R507.1 U50.5)
SENSOR5_EN: 08_MCU (R58.2), 13_FLOW_Sensor (R190.1 U19.5)
SENSOR_I2C1_SCL: 05_POWER_MCU_2 (R626.1), 08_MCU (R62.1), 09_MRAM_RTC_WDT (R118.1 R391.1), 12_TEC (R117.1), 13_Sensors_Onboard (R628.1 R630.1)
SENSOR_I2C1_SDA: 05_POWER_MCU_2 (R621.1), 08_MCU (R59.1), 09_MRAM_RTC_WDT (R392.1 R620.1), 12_TEC (R79.1), 13_Sensors_Onboard (R629.1 R631.1)
SHDN: 06_SAMA7G54-PMIC (R304.1), 06_SAMA7G54-MPU (U54.R9)
SOM_CAM_CK_N: 06_SOM_CAM (U44.7), 06_SAMA7G54-MPU (R349.1)
SOM_CAM_CK_P: 06_SOM_CAM (U44.6), 06_SAMA7G54-MPU (R351.1)
SOM_CAM_D0_N: 06_SOM_CAM (U44.10), 06_SAMA7G54-MPU (R353.1)
SOM_CAM_D0_P: 06_SOM_CAM (U44.8), 06_SAMA7G54-MPU (R355.1)
SOM_CAM_D1_N: 06_SOM_CAM (U44.12), 06_SAMA7G54-MPU (R356.1)
SOM_CAM_D1_P: 06_SOM_CAM (U44.11), 06_SAMA7G54-MPU (R357.1)
SOM_CAM_I2C_EN1: 06_SOM_CAM (R466.1 U45.5), 06_SAMA7G54-PIO (R565.1)
SOM_CAM_I2C_EN2: 06_SOM_CAM (R473.1 U46.5), 06_SAMA7G54-PIO (R566.1)
SOM_CAM_I2C_SCL: 06_SOM_CAM (R459.2 U45.2 U46.2), 06_SAMA7G54-PIO (R558.1)
SOM_CAM_I2C_SDA: 06_SOM_CAM (R458.2 U45.3 U46.3), 06_SAMA7G54-PIO (R559.1)
SOM_CAM_MIPI_SEL: 06_SOM_CAM (R319.2 U44.13), 06_SAMA7G54-PIO (R567.1)
SOM_CONSOLE_RX: 06_SOM_Console (J16.3 R210.1), 06_SAMA7G54-PIO (R557.1)
SOM_CONSOLE_TX: 06_SOM_Console (J16.2 R209.1), 06_SAMA7G54-PIO (R556.1)
SOM_EMMC_nRST: 07_eMMC (R208.1 U22.M5), 06_SAMA7G54-PIO (R374.1)
SOM_MRAM_QSPI_CLK: 06_SOM_USB_CARD (U47.6), 06_SAMA7G54-PIO (R468.1)
SOM_MRAM_QSPI_IO0: 06_SOM_USB_CARD (U47.5), 06_SAMA7G54-PIO (R465.1)
SOM_MRAM_QSPI_IO1: 06_SOM_USB_CARD (U47.2), 06_SAMA7G54-PIO (R464.1)
SOM_MRAM_QSPI_IO2: 06_SOM_USB_CARD (U47.3), 06_SAMA7G54-PIO (R462.1)
SOM_MRAM_QSPI_IO3: 06_SOM_USB_CARD (U47.7), 06_SAMA7G54-PIO (R456.1)
SOM_PHOTO_ADC_CONV: 04_CONNECTOR_OUT (R301.2 R316.1), 06_SAMA7G54-PIO (R470.1)
SOM_PHOTO_ADC_EOC: 04_CONNECTOR_OUT (R302.2 R317.1), 06_SAMA7G54-PIO (R560.1)
SOM_PHOTO_ADC_nCS: 04_CONNECTOR_OUT (R300.2 R315.1), 06_SAMA7G54-PIO (R383.1)
SOM_PHOTO_SPI_MISO: 04_CONNECTOR_OUT (R311.1), 06_SAMA7G54-PIO (R377.1)
SOM_PHOTO_SPI_MOSI: 04_CONNECTOR_OUT (R309.1), 06_SAMA7G54-PIO (R375.1)
SOM_PHOTO_SPI_SCK: 04_CONNECTOR_OUT (R307.1), 06_SAMA7G54-PIO (R380.1)
SOM_PHOTO_SW_nCS: 04_CONNECTOR_OUT (R299.2 R313.1), 06_SAMA7G54-PIO (R373.1)
SOM_PRAM_nCS: 09_MRAM_RTC_WDT (R530.1 U37.3), 06_SAMA7G54-PIO (R538.1)
SOM_PRAM_SPI_MISO: 09_MRAM_RTC_WDT (U37.13), 06_SAMA7G54-PIO (R540.1)
SOM_PRAM_SPI_MOSI: 09_MRAM_RTC_WDT (U37.10), 06_SAMA7G54-PIO (R539.1)
SOM_PRAM_SPI_SCK: 09_MRAM_RTC_WDT (U37.6), 06_SAMA7G54-PIO (R537.1)
SOM_RAM_QSPI_nCS: 06_SOM_USB_CARD (R469.1 U47.1), 06_SAMA7G54-PIO (R467.1)
SOM_SDMMC0_OUT_CK: 07_eMMC (R207.1 U22.P6), 06_SAMA7G54-PIO (R371.1)
SOM_SDMMC0_OUT_CMD: 07_eMMC (R206.1 U22.P5), 06_SAMA7G54-PIO (R372.1)
SOM_SDMMC0_OUT_D0: 07_eMMC (R205.1 U22.K2), 06_SAMA7G54-PIO (R376.1)
SOM_SDMMC0_OUT_D1: 07_eMMC (R204.1 U22.N2), 06_SAMA7G54-PIO (R378.1)
SOM_SDMMC0_OUT_D2: 07_eMMC (R203.1 U22.K3), 06_SAMA7G54-PIO (R381.1)
SOM_SDMMC0_OUT_D3: 07_eMMC (R202.1 U22.N3), 06_SAMA7G54-PIO (R384.1)
SOM_SDMMC0_OUT_D4: 07_eMMC (R201.1 U22.N8), 06_SAMA7G54-PIO (R386.1)
SOM_SDMMC0_OUT_D5: 07_eMMC (R200.1 U22.K8), 06_SAMA7G54-PIO (R404.1)
SOM_SDMMC0_OUT_D6: 07_eMMC (R199.1 U22.N9), 06_SAMA7G54-PIO (R455.1)
SOM_SDMMC0_OUT_D7: 07_eMMC (R198.1 U22.K9), 06_SAMA7G54-PIO (R457.1)
SOM_SDMMC0_OUT_DS: 07_eMMC (U22.K5), 06_SAMA7G54-PIO (R463.1)
SOM_USB_LED_1: 07_USB (R86.1), 06_SAMA7G54-PIO (R568.1)
SOM_USB_LED_2: 07_USB (R91.1), 06_SAMA7G54-PIO (R475.1)
SOM_USB_N: 07_USB (U3.3), 06_SAMA7G54-MPU (R345.1)
SOM_USB_P: 07_USB (U3.2), 06_SAMA7G54-MPU (R346.1)
SOM_USB_PWR_EN1: 07_USB (R96.1 U4.1), 06_SAMA7G54-PIO (R387.1)
SOM_USB_PWR_EN2: 07_USB (R95.1 U4.4), 06_SAMA7G54-PIO (R454.1)
SOM_USB_SW_nOE: 07_USB (R84.2 U3.15), 06_SAMA7G54-PIO (R379.1)
SOM_USB_SW_SEL0: 07_USB (R89.1 U3.6), 06_SAMA7G54-PIO (R382.1)
SOM_USB_SW_SEL1: 07_USB (R88.1 U3.5), 06_SAMA7G54-PIO (R385.1)
TEC_nCS_1: 08_MCU (R68.2), 12_TEC (R97.2 U5.15)
TEC_nCS_2: 08_MCU (R70.2), 12_TEC (R107.2 U7.15)
TEC_nCS_3: 08_MCU (R72.2), 12_TEC (R98.2 U6.15)
TEC_nCS_4: 08_MCU (R20.1), 12_TEC (R108.2 U8.15)
TEC_SWEN_1: 08_MCU (R41.2), 12_TEC (R103.1 U5.13)
TEC_SWEN_2: 08_MCU (R285.1), 12_TEC (R113.1 U7.13)
TEC_SWEN_3: 08_MCU (R47.2), 12_TEC (R105.1 U6.13)
TEC_SWEN_4: 08_MCU (R48.2), 12_TEC (R115.1 U8.13)
TEMP _SENSOR: 08_MCU (R527.2), 10_NTC_TEMPSENSOR (R157.2)
USB1_N: 06_SOM_USB_CARD (J14.2), 06_SAMA7G54-MPU (R341.1)
USB1_P: 06_SOM_USB_CARD (J14.3), 06_SAMA7G54-MPU (R342.1)
WD_DONE: 08_MCU (R293.1), 09_MRAM_RTC_WDT (U39.4)
WD_nRESET: 08_MCU (R45.2), 09_MRAM_RTC_WDT (R394.2 R400.1)
WD_WAKE: 08_MCU (R294.1), 09_MRAM_RTC_WDT (U39.5)
WKUP: 06_SAMA7G54-PMIC (R322.1 U34.7), 06_SAMA7G54-MPU (U54.AA15)